# Altium project NBP3 Altera MAX7000 MAX3000 PLCC Rev1.00.PrjPcb
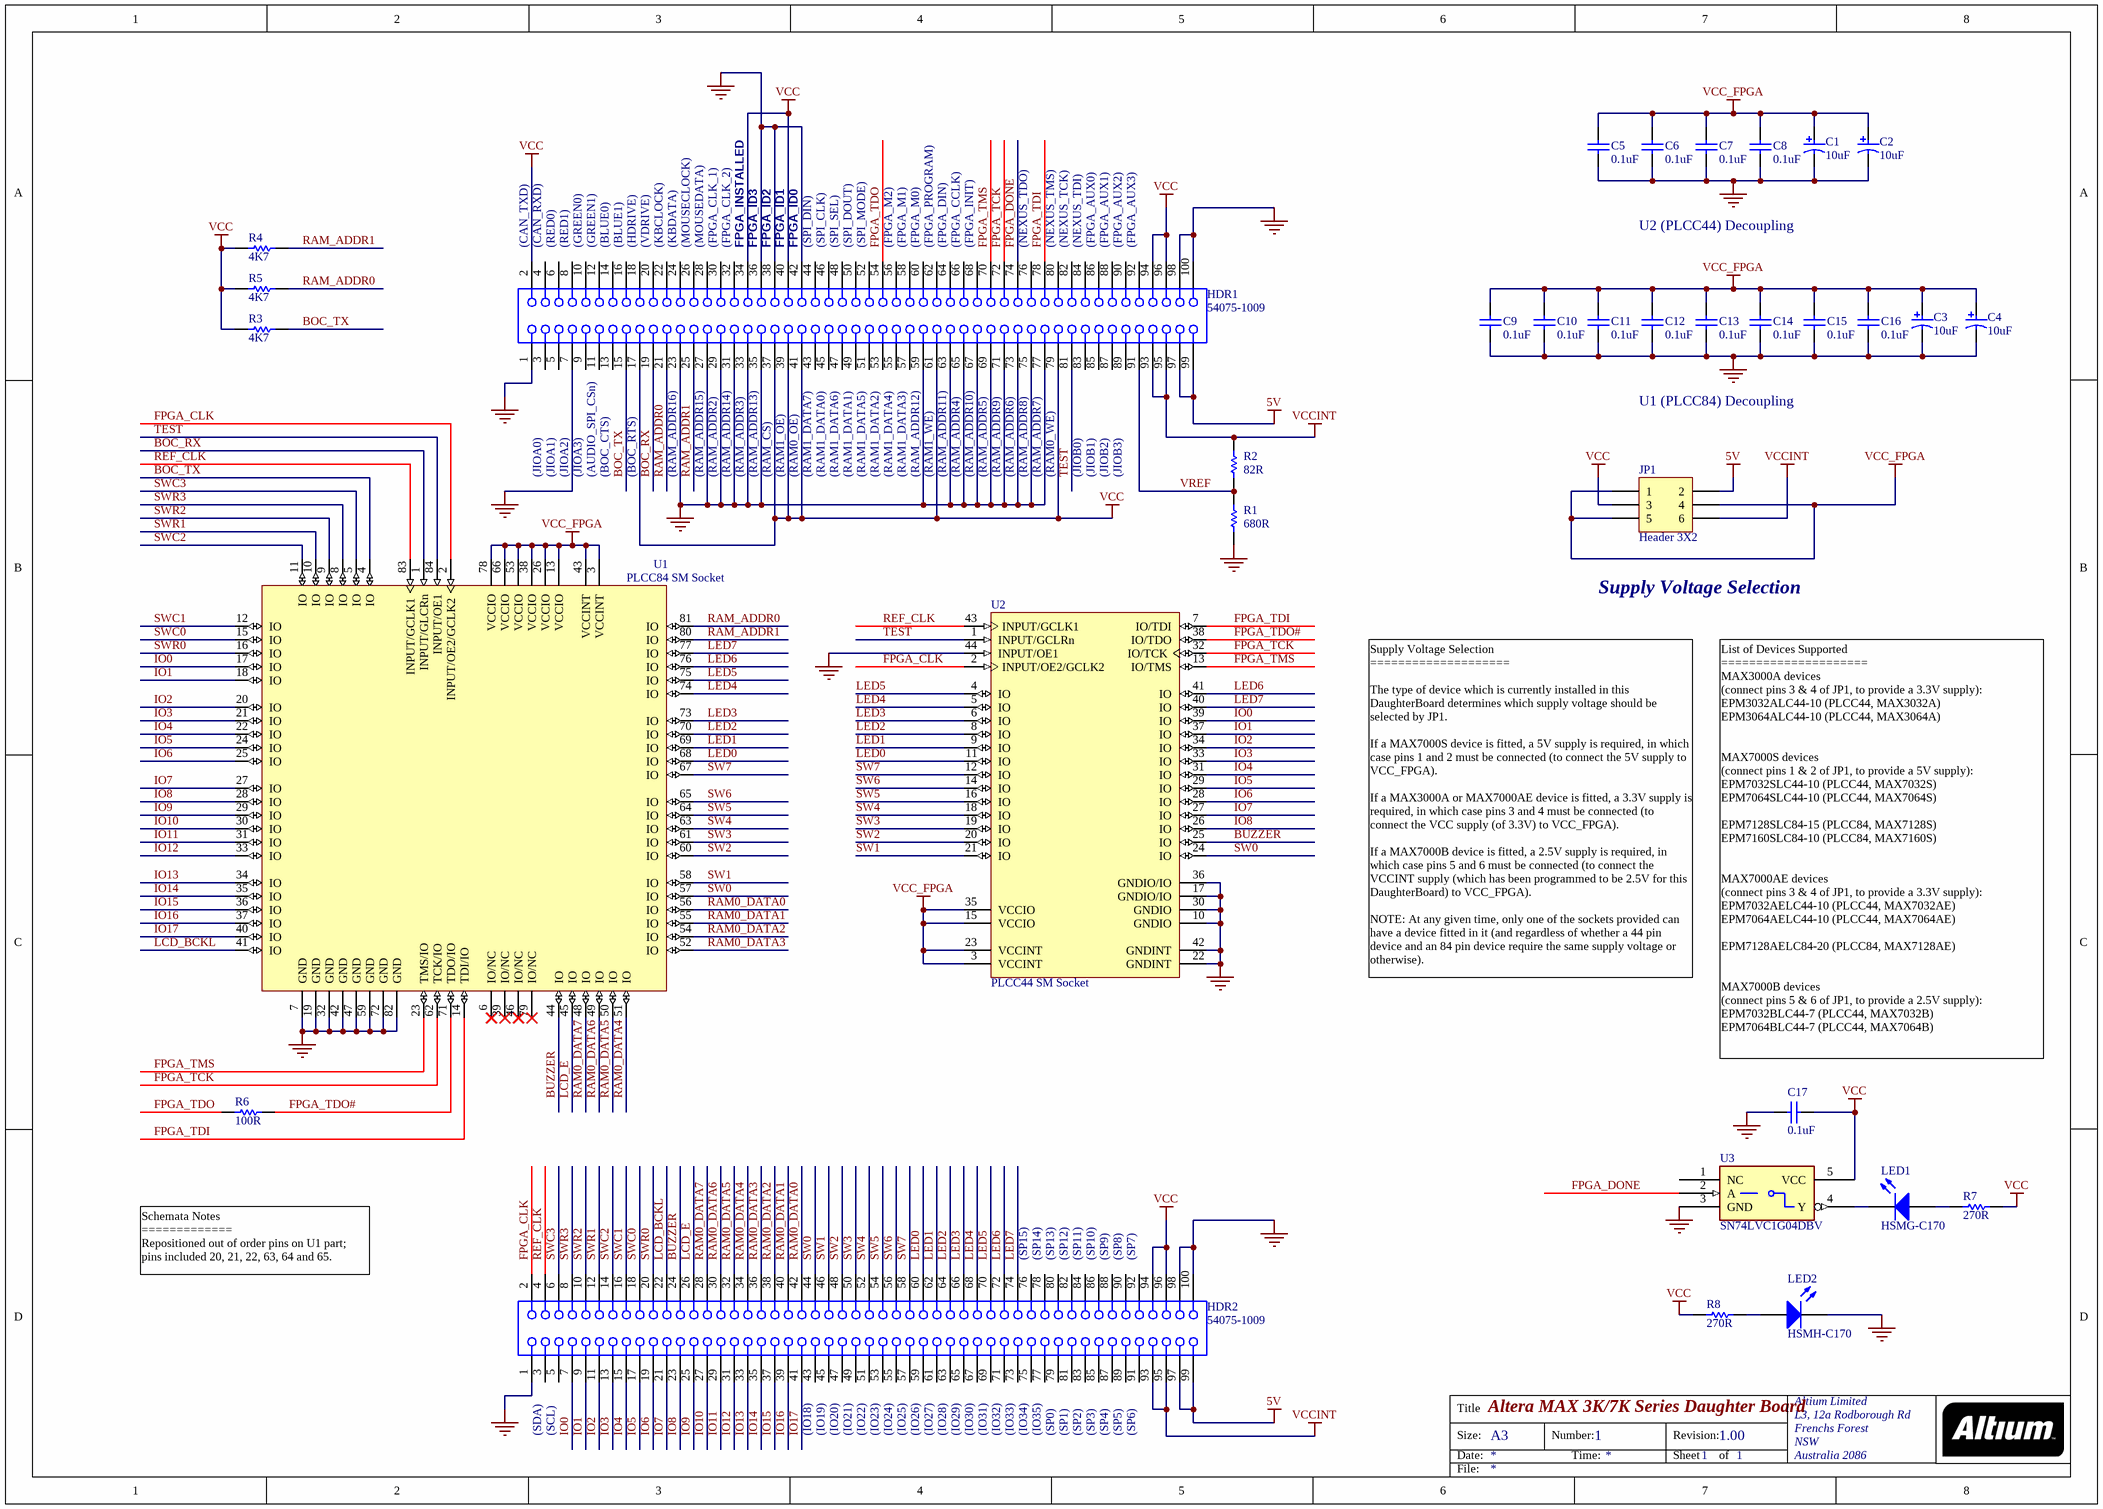
[diagram p0: NBP3 Altera MAX7000 MAX3000 PLCC Rev1.00.SchDoc]
1 sheet, 33 parts. Net scope: global (net labels, ports and power ports of the same name join across sheets).
Board file: NBP3 Altera MAX7000 MAX3000 PLCC Rev1.00.PcbDoc

## Sheet NBP3 Altera MAX7000 MAX3000 PLCC Rev1.00.SchDoc: Altera MAX 3K/7K Series Daughter Board
size A3; Organization: Altium Limited; Address1: L3, 12a Rodborough Rd; Address2: Frenchs Forest; Address3: NSW; Address4: Australia 2086; DocumentNumber: 1; Revision: 1.00; SheetNumber: 1; SheetTotal: 1

### Parts
C1  10uF  [MCCT-B]
C2  10uF  [MCCT-B]
C3  10uF  [MCCT-B]
C4  10uF  [MCCT-B]
C5  0.1uF  [CC2012-0805]
C6  0.1uF  [CC2012-0805]
C7  0.1uF  [CC2012-0805]
C8  0.1uF  [CC2012-0805]
C9  0.1uF  [CC2012-0805]
C10  0.1uF  [CC2012-0805]
C11  0.1uF  [CC2012-0805]
C12  0.1uF  [CC2012-0805]
C13  0.1uF  [CC2012-0805]
C14  0.1uF  [CC2012-0805]
C15  0.1uF  [CC2012-0805]
C16  0.1uF  [CC2012-0805]
C17  0.1uF  [CC2012-0805]
HDR1  54075-1009  [54075]
HDR2  54075-1009  [54075]
JP1  Header 3X2  [HDR2X3]
LED1  HSMG-C170  [SMD _LED]
LED2  HSMH-C170  [SMD _LED]
R1  680R  [CC2012-0805]
R2  82R  [CC2012-0805]
R3  4K7  [CC2012-0805]
R4  4K7  [CC2012-0805]
R5  4K7  [CC2012-0805]
R6  100R  [CC2012-0805]
R7  270R  [CC2012-0805]
R8  270R  [CC2012-0805]
U1  PLCC84 SM Socket  [PLCC84_SKT_SM]
U2  PLCC44 SM Socket  [PLCC44_SKT_SM]
U3  SN74LVC1G04DBV  [SO-G5/P.95]

### Nets
5V: HDR1.97 HDR1.99 HDR2.97 HDR2.99 JP1.2
GND: C1.2 C2.2 C3.2 C4.2 C5.2 C6.2 C7.2 C8.2 C9.1 C10.1 C11.1 C12.2 C13.1 C14.2 C15.2 C16.2 C17.2 HDR1.1 HDR1.7 HDR1.23 HDR1.27 HDR1.29 HDR1.31 HDR1.33 HDR1.35 HDR1.36 HDR1.38 HDR1.42 HDR1.59 HDR1.63 HDR1.65 HDR1.67 HDR1.69 HDR1.71 HDR1.73 HDR1.75 HDR1.77 HDR1.98 HDR1.100 HDR2.1 HDR2.98 HDR2.100 LED2.2(K) R1.2 U1.7(GND) U1.19(GND) U1.32(GND) U1.42(GND) U1.47(GND) U1.59(GND) U1.72(GND) U1.82(GND) U2.10(GNDIO) U2.17(GNDIO/IO) U2.22(GNDINT) U2.30(GNDIO) U2.36(GNDIO/IO) U2.42(GNDINT) U2.44(INPUT/OE1) U3.3(GND)
VCC: C17.1 HDR1.2 HDR1.17 HDR1.34 HDR1.37 HDR1.39 HDR1.40 HDR1.41 HDR1.61 HDR1.79 HDR1.94 HDR1.96 HDR2.94 HDR2.96 JP1.3 R3.1 R4.1 R5.1 R7.1 R8.1 U3.5(VCC)
VCC_FPGA: C1.1 C2.1 C3.1 C4.1 C5.1 C6.1 C7.1 C8.1 C9.2 C10.2 C11.2 C12.1 C13.2 C14.1 C15.1 C16.1 JP1.1 JP1.4 JP1.5 U1.3(VCCINT) U1.13(VCCIO) U1.26(VCCIO) U1.38(VCCIO) U1.43(VCCINT) U1.53(VCCIO) U1.66(VCCIO) U1.78(VCCIO) U2.3(VCCINT) U2.15(VCCIO) U2.23(VCCINT) U2.35(VCCIO)
VCCINT: HDR1.93 HDR1.95 HDR2.93 HDR2.95 JP1.6 R2.1
BOC_RX: HDR1.19 U1.1(INPUT/GLCRn)
BOC_TX: HDR1.15 R3.2 U1.4(IO)
BUZZER: HDR2.24 U1.44(IO) U2.25(IO)
FPGA_CLK: HDR2.2 U1.2(INPUT/OE2/GCLK2) U2.2(INPUT/OE2/GCLK2)
FPGA_DONE: HDR1.74 U3.2(A)
FPGA_TCK: HDR1.72 U1.62(TCK/IO) U2.32(IO/TCK)
FPGA_TDI: HDR1.78 U1.14(TDI/IO) U2.7(IO/TDI)
FPGA_TDO: HDR1.54 R6.1
FPGA_TDO#: R6.2 U1.71(TDO/IO) U2.38(IO/TDO)
FPGA_TMS: HDR1.70 U1.23(TMS/IO) U2.13(IO/TMS)
IO0: HDR2.7 U1.17(IO) U2.39(IO)
IO1: HDR2.9 U1.18(IO) U2.37(IO)
IO2: HDR2.11 U1.20(IO) U2.34(IO)
IO3: HDR2.13 U1.21(IO) U2.33(IO)
IO4: HDR2.15 U1.22(IO) U2.31(IO)
IO5: HDR2.17 U1.24(IO) U2.29(IO)
IO6: HDR2.19 U1.25(IO) U2.28(IO)
IO7: HDR2.21 U1.27(IO) U2.27(IO)
IO8: HDR2.23 U1.28(IO) U2.26(IO)
IO9: HDR2.25 U1.29(IO)
IO10: HDR2.27 U1.30(IO)
IO11: HDR2.29 U1.31(IO)
IO12: HDR2.31 U1.33(IO)
IO13: HDR2.33 U1.34(IO)
IO14: HDR2.35 U1.35(IO)
IO15: HDR2.37 U1.36(IO)
IO16: HDR2.39 U1.37(IO)
IO17: HDR2.41 U1.40(IO)
LCD_BCKL: HDR2.22 U1.41(IO)
LCD_E: HDR2.26 U1.45(IO)
LED0: HDR2.60 U1.68(IO) U2.11(IO)
LED1: HDR2.62 U1.69(IO) U2.9(IO)
LED2: HDR2.64 U1.70(IO) U2.8(IO)
LED3: HDR2.66 U1.73(IO) U2.6(IO)
LED4: HDR2.68 U1.74(IO) U2.5(IO)
LED5: HDR2.70 U1.75(IO) U2.4(IO)
LED6: HDR2.72 U1.76(IO) U2.41(IO)
LED7: HDR2.74 U1.77(IO) U2.40(IO)
RAM0_DATA0: HDR2.42 U1.56(IO)
RAM0_DATA1: HDR2.40 U1.55(IO)
RAM0_DATA2: HDR2.38 U1.54(IO)
RAM0_DATA3: HDR2.36 U1.52(IO)
RAM0_DATA4: HDR2.34 U1.51(IO)
RAM0_DATA5: HDR2.32 U1.50(IO)
RAM0_DATA6: HDR2.30 U1.49(IO)
RAM0_DATA7: HDR2.28 U1.48(IO)
RAM_ADDR0: HDR1.21 R5.2 U1.81(IO)
RAM_ADDR1: HDR1.25 R4.2 U1.80(IO)
REF_CLK: HDR2.4 U1.83(INPUT/GCLK1) U2.43(INPUT/GCLK1)
SW0: HDR2.44 U1.57(IO) U2.24(IO)
SW1: HDR2.46 U1.58(IO) U2.21(IO)
SW2: HDR2.48 U1.60(IO) U2.20(IO)
SW3: HDR2.50 U1.61(IO) U2.19(IO)
SW4: HDR2.52 U1.63(IO) U2.18(IO)
SW5: HDR2.54 U1.64(IO) U2.16(IO)
SW6: HDR2.56 U1.65(IO) U2.14(IO)
SW7: HDR2.58 U1.67(IO) U2.12(IO)
SWC0: HDR2.18 U1.15(IO)
SWC1: HDR2.16 U1.12(IO)
SWC2: HDR2.14 U1.11(IO)
SWC3: HDR2.6 U1.5(IO)
SWR0: HDR2.20 U1.16(IO)
SWR1: HDR2.12 U1.10(IO)
SWR2: HDR2.10 U1.9(IO)
SWR3: HDR2.8 U1.8(IO)
TEST: HDR1.81 U1.84(INPUT/OE1) U2.1(INPUT/GCLRn)
VREF: HDR1.91 R1.1 R2.2
NetLED1_1: LED1.1(A) R7.2
NetLED1_2: LED1.2(K) U3.4(Y)
NetLED2_1: LED2.1(A) R8.2

Not connected (* = marked no-connect by the designer): HDR1 3 4 5 6 8 9 10 11 12 13 14 16 18 20 22 24 26 28 30 32 43 44 45 46 47 48 49 50 51 52 53 55 56 57 58 60 62 64 66 68 76 80 82 83 84 85 86 87 88 89 90 92; HDR2 3 5 43 45 47 49 51 53 55 57 59 61 63 65 67 69 71 73 75 76 77 78 79 80 81 82 83 84 85 86 87 88 89 90 91 92; U1 6(IO/NC)* 39(IO/NC)* 46(IO/NC)* 79(IO/NC)*; U3 1(NC)

### Notes on the sheet
- (near HDR1) (CAN_TXD)
- (near HDR1) (CAN_RXD)
- (near HDR1) (RED0)
- (near HDR1) (RED1)
- (near HDR1) (GREEN0)
- (near HDR1) (GREEN1)
- (near HDR1) (BLUE0)
- (near HDR1) (BLUE1)
- (near HDR1) (HDRIVE)
- (near HDR1) (VDRIVE)
- (near HDR1) (KBCLOCK)
- (near HDR1) (KBDATA)
- (near HDR1) (MOUSECLOCK)
- (near HDR1) (MOUSEDATA)
- (near HDR1) (FPGA_CLK_1)
- (near HDR1) (FPGA_CLK_2)
- (near HDR1) FPGA_INSTALLED
- (near HDR1) FPGA_ID3
- (near HDR1) FPGA_ID2
- (near HDR1) FPGA_ID1
- (near HDR1) FPGA_ID0
- (near HDR1) (SPI_DIN)
- (near HDR1) (SPI_CLK)
- (near HDR1) (SPI_SEL)
- (near HDR1) (SPI_DOUT)
- (near HDR1) (SPI_MODE)
- (near HDR1) (FPGA_M2)
- (near HDR1) (FPGA_M1)
- (near HDR1) (FPGA_M0)
- (near HDR1) (FPGA_PROGRAM)
- (near HDR1) (FPGA_DIN)
- (near HDR1) (FPGA_CCLK)
- (near HDR1) (FPGA_INIT)
- (near HDR1) (NEXUS_TDO)
- (near HDR1) (NEXUS_TMS)
- (near HDR1) (NEXUS_TCK)
- (near HDR1) (NEXUS_TDI)
- (near HDR1) (FPGA_AUX0)
- (near HDR1) (FPGA_AUX1)
- (near HDR1) (FPGA_AUX2)
- (near HDR1) (FPGA_AUX3)
- U2 (PLCC44) Decoupling
- U1 (PLCC84) Decoupling
- (JIOA0)
- (JIOA1)
- (JIOA2)
- (JIOA3)
- (near HDR1) (AUDIO_SPI_CSn)
- (BOC_CTS)
- (BOC_RTS)
- (RAM_ADDR16)
- (RAM_ADDR15)
- (RAM_ADDR2)
- (RAM_ADDR14)
- (RAM_ADDR3)
- (RAM_ADDR13)
- (RAM_CS)
- (RAM1_OE)
- (RAM0_OE)
- (RAM1_DATA7)
- (RAM1_DATA0)
- (RAM1_DATA6)
- (RAM1_DATA1)
- (RAM1_DATA5)
- (RAM1_DATA2)
- (RAM1_DATA4)
- (RAM1_DATA3)
- (RAM_ADDR12)
- (RAM1_WE)
- (RAM_ADDR11)
- (RAM_ADDR4)
- (RAM_ADDR10)
- (RAM_ADDR5)
- (RAM_ADDR9)
- (RAM_ADDR6)
- (RAM_ADDR8)
- (RAM_ADDR7)
- (RAM0_WE)
- (JIOB0)
- (JIOB1)
- (JIOB2)
- (JIOB3)
- Supply Voltage Selection
- Supply Voltage Selection
  ====================
  The type of device which is currently installed in this DaughterBoard determines which supply voltage should be selected by JP1.
  If a MAX7000S device is fitted, a 5V supply is required, in which case pins 1 and 2 must be connected (to connect the 5V supply to VCC_FPGA).
  If a MAX3000A or MAX7000AE device is fitted, a 3.3V supply is required, in which case pins 3 and 4 must be connected (to connect the VCC supply (of 3.3V) to VCC_FPGA).
  If a MAX7000B device is fitted, a 2.5V supply is required, in which case pins 5 and 6 must be connected (to connect the VCCINT supply (which has been programmed to be 2.5V for this DaughterBoard) to VCC_FPGA).
  NOTE: At any given time, only one of the sockets provided can have a device fitted in it (and regardless of whether a 44 pin device and an 84 pin device require the same supply voltage or otherwise).
- List of Devices Supported
  =====================
  MAX3000A devices
  (connect pins 3 & 4 of JP1, to provide a 3.3V supply):
  EPM3032ALC44-10 (PLCC44, MAX3032A)
  EPM3064ALC44-10 (PLCC44, MAX3064A)
  MAX7000S devices
  (connect pins 1 & 2 of JP1, to provide a 5V supply):
  EPM7032SLC44-10 (PLCC44, MAX7032S)
  EPM7064SLC44-10 (PLCC44, MAX7064S)
  EPM7128SLC84-15 (PLCC84, MAX7128S)
  EPM7160SLC84-10 (PLCC84, MAX7160S)
  MAX7000AE devices
  (connect pins 3 & 4 of JP1, to provide a 3.3V supply):
  EPM7032AELC44-10 (PLCC44, MAX7032AE)
  EPM7064AELC44-10 (PLCC44, MAX7064AE)
  EPM7128AELC84-20 (PLCC84, MAX7128AE)
  MAX7000B devices
  (connect pins 5 & 6 of JP1, to provide a 2.5V supply):
  EPM7032BLC44-7 (PLCC44, MAX7032B)
  EPM7064BLC44-7 (PLCC44, MAX7064B)
- (near HDR2) (SP15)
- (near HDR2) (SP14)
- (near HDR2) (SP13)
- (near HDR2) (SP12)
- (near HDR2) (SP11)
- (near HDR2) (SP10)
- (near HDR2) (SP9)
- (near HDR2) (SP8)
- (near HDR2) (SP7)
- Schemata Notes
  =============
  Repositioned out of order pins on U1 part;
  pins included 20, 21, 22, 63, 64 and 65.
- (near HDR2) (SDA)
- (near HDR2) (SCL)
- (near HDR2) (IO18)
- (near HDR2) (IO19)
- (near HDR2) (IO20)
- (near HDR2) (IO21)
- (near HDR2) (IO22)
- (near HDR2) (IO23)
- (near HDR2) (IO24)
- (near HDR2) (IO25)
- (near HDR2) (IO26)
- (near HDR2) (IO27)
- (near HDR2) (IO28)
- (near HDR2) (IO29)
- (near HDR2) (IO30)
- (near HDR2) (IO31)
- (near HDR2) (IO32)
- (near HDR2) (IO33)
- (near HDR2) (IO34)
- (near HDR2) (IO35)
- (near HDR2) (SP0)
- (near HDR2) (SP1)
- (near HDR2) (SP2)
- (near HDR2) (SP3)
- (near HDR2) (SP4)
- (near HDR2) (SP5)
- (near HDR2) (SP6)
- Title
- Size:
- Date:
- A3
- Number:
- Time:
- Revision:
- Sheet
- of
- File:

### Library data of the parts
C1-C4 = CAP_POLAR: Polar Capacitor
  C2-C4: Supplier: FARNELL; Supplier Code: 967-117
C5-C17 = CAP: Capacitor
HDR1 HDR2 = 54075-1009: Board-to-Board, Docking Station, 0.80mm (.031") Pitch, Shielded Receptacle, Vertical, Ultra Low Profile, SMT; Manufacturer: Molex; Package Information: Latest Revision: Jun-2001; Mating Height: 8.5mm; Voltage: 100V; Current: 0.5A; Contact Resistance: 40mOhm max; PCB Layout: Complies with Manufacturer's Recommendation.; Published: 15-Oct-2003; Datasheet: Latest Revision: Feb-2002; Package Reference: 54075; Publisher: Altium Limited
JP1 = Header 3X2: Header, 3-Pin, Dual row; Revision: 17-Jul-2002: Re-released for DXP Platform.; Publisher: Altium Limited
LED1 LED2 = HSMX-C670: Typical RED GaAs SMD LED Agilent make; Manufacturer: Generic Components; Class I: Optoelectronic; Fitted: True; Published: 8-Jun-2000; Revision: July-2002: Re-released for DXP Platform.; Publisher: Altium Limited; Class II: LED
R1-R8 = RES: Resistor
U1 = EPM7160SLC84-10: MAX 7000S 5V In-System Programmable CPLD, 160 Macrocells, 84-Pin PLCC, Speed Grade 10, Commercial Grade; Package Information: Latest Revision: ver11.0, Feb-2003; Code - JEDEC: MS-018-AF; Code - IPC: PLCC-84; Published: 24-Nov-2000; Revision: 17-Jul-2002: Re-released for DXP Platform.; Datasheet: Latest Revision: ver6.6, Jun-2003; Package Reference: PLCC84; Publisher: Altium Limited
U2 = EPM3032ALC44-10: MAX 3032, 44-Pin PLCC, Speed Grade 10, Commercial Grade; Package Information: Latest Revision: ver11.0, Feb-2003; Code - IPC: PLCC-44; Published: 23-Sep-2002; Datasheet: Latest Revision: ver3.4, Jun-2003; Package Reference: PLCC44; Publisher: Altium Limited
U3 = SN74AHC1G04DBVR: Manufacturer: TI; Fitted: True